# Altium project BT840_Temp.PrjPcb
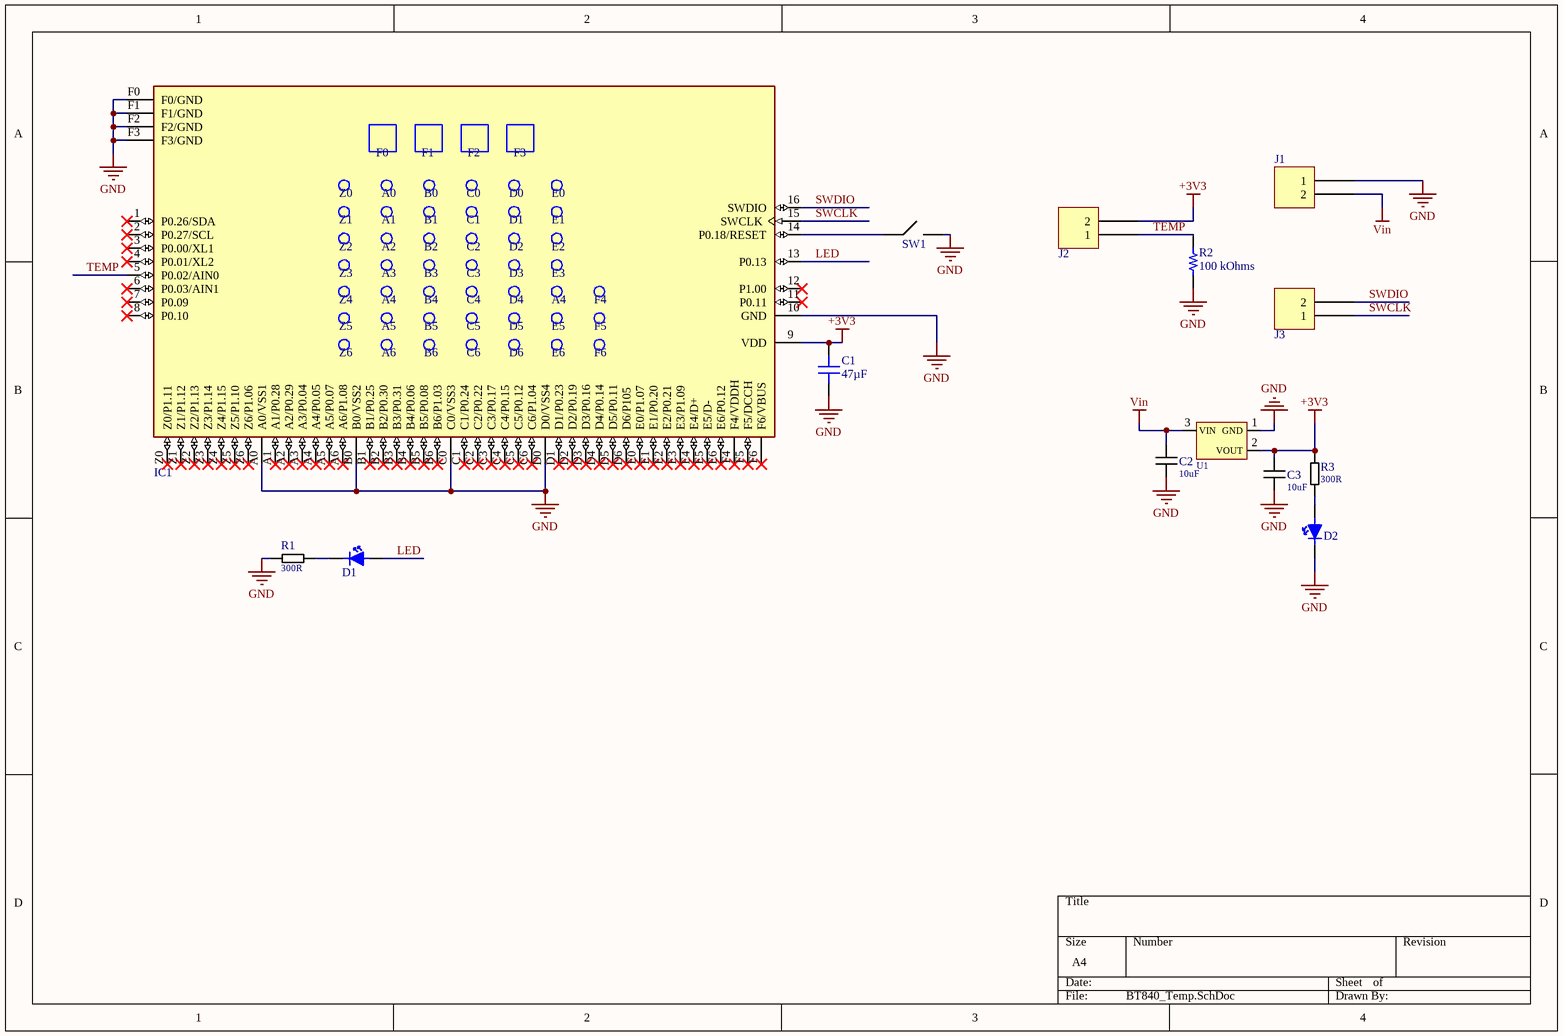
[diagram p0: BT840_Temp.SchDoc]
1 sheet, 14 parts. Net scope: global (net labels, ports and power ports of the same name join across sheets).
Board file: BT840_Temp.PcbDoc

## Sheet BT840_Temp.SchDoc
size A4; SheetNumber: 1; SheetTotal: 1

### Parts
C1  47µF  [CAP 1206_3216 - 1.8MM]
C2  Capacitance: 10uF  [CAP_1206]  (hidden comment: C1206C106J4RAC7800)
C3  Capacitance: 10uF  [CAP_1206]  (hidden comment: C1206C106J4RAC7800)
D1  LED TH  [TH_LED]  (value not drawn)
D2  LED TH  [TH_LED]  (value not drawn)
IC1  BT480F  [BT840F]  (value not drawn)
J1  B2B-PH-K-S(LF)(SN)  [JST B2B-PH-K]  (value not drawn)
J2  B2B-PH-K-S(LF)(SN)  [JST B2B-PH-K]  (value not drawn)
J3  B2B-PH-K-S(LF)(SN)  [JST B2B-PH-K]  (value not drawn)
R1  Resistance: 300R  [RES_1206]  (hidden comment: RT1206BRD07300RL)
R2  100 kOhms  [RES 1206_3216]
R3  Resistance: 300R  [RES_1206]  (hidden comment: RT1206BRD07300RL)
SW1  PTS636 SM43J SMTR LFS  [SMD_Button]  (value not drawn)
U1  AMS1117-3.3V  [SOT223]  (value not drawn)

### Nets
+3V3: C1.2 C3.2 IC1.9(VDD) J2.2 R3.2 U1.2(VOUT)
GND: C1.1 C2.1 C3.1 D2.1 IC1.10(GND) IC1.A0(A0/VSS1) IC1.B0(B0/VSS2) IC1.C0(C0/VSS3) IC1.D0(D0/VSS4) IC1.F0(F0/GND) IC1.F1(F1/GND) IC1.F2(F2/GND) IC1.F3(F3/GND) J1.1 R1.1 R2.1 SW1.2 U1.1(GND)
Vin: C2.2 J1.2 U1.3(VIN)
LED: D1.2 IC1.13(P0.13)
SWCLK: IC1.15(SWCLK) J3.1
SWDIO: IC1.16(SWDIO) J3.2
TEMP: IC1.5(P0.02/AIN0) J2.1 R2.2
NetD1_1: D1.1 R1.2
NetD2_2: D2.2 R3.1
NetIC1_14: IC1.14(P0.18/RESET) SW1.1

Not connected (* = marked no-connect by the designer): IC1 1(P0.26/SDA)* 2(P0.27/SCL)* 3(P0.00/XL1)* 4(P0.01/XL2)* 6(P0.03/AIN1)* 7(P0.09)* 8(P0.10)* 11(P0.11)* 12(P1.00)* A1(A1/P0.28)* A2(A2/P0.29)* A3(A3/P0.04)* A4(A4/P0.05)* A5(A5/P0.07)* A6(A6/P1.08)* B1(B1/P0.25)* B2(B2/P0.30)* B3(B3/P0.31)* B4(B4/P0.06)* B5(B5/P0.08)* B6(B6/P1.03)* C1(C1/P0.24)* C2(C2/P0.22)* C3(C3/P0.17)* C4(C4/P0.15)* C5(C5/P0.12)* C6(C6/P1.04)* D1(D1/P0.23)* D2(D2/P0.19)* D3(D3/P0.16)* D4(D4/P0.14)* D5(D5/P0.11)* D6(D6/P105)* E0(E0/P1.07)* E1(E1/P0.20)* E2(E2/P0.21)* E3(E3/P1.09)* E4(E4/D+)* E5(E5/D-)* E6(E6/P0.12)* F4(F4/VDDH)* F5(F5/DCCH)* F6(F6/VBUS)* Z0(Z0/P1.11)* Z1(Z1/P1.12)* Z2(Z2/P1.13)* Z3(Z3/P1.14)* Z4(Z4/P1.15)* Z5(Z5/P1.10)* Z6(Z6/P1.06)*

### Library data of the parts
C1 = 12066D476MAT2A: CAP CER 47UF 6.3V X5R 1206; manufacturer: AVX Corporation; Tolerance: ±20%; Part Number: 12066D476MAT2A; Value: 47µF; Applications: General Purpose; Capacitance: 47µF; componentlink1description: Datasheet; componentlink1url: http://datasheets.avx.com/cx5r.pdf; componentlink2description: DigiKey Link; componentlink2url: http://digikey.com/product-detail/en/avx-corporation/12066D476MAT2A/478-4532-1-ND/1645883; Device Package: 1206 (3216 Metric); lastupdated: 2.09.2020 01:05:23; Lifecycle Status: Active; Minimum Order: 1; Mounting Type: Surface Mount, MLCC; Operating Temperature: -55°C ~ 85°C; Package / Case: 1206 (3216 Metric); packaging: TapeAndReel; partid: 22636; Part Status: Active; price: 0.23; series: -; Size / Dimension: 0.126" L x 0.063" W (3.20mm x 1.60mm); Supplier 1: DigiKey; Supplier Part Number 1: 478-4532-1-ND; Temperature Coefficient: X5R; Thickness (Max): 0.070" (1.78mm); Voltage - Rated: 6.3V
C2 C3 = CAP 10uF 1206: Cap Ceramic 10uF 16V ±%5 SMD 1206; Manufacturer: KEMET; Manufacturer Part Number: C1206C106J4RACTU; Designed by: Semih AŞÇI; Tolerance: 5%; Dielectric: X7R; Supplier 1: Arrow Electronics; RoHS: Yes; Category: Ceramic Capacitors; Stock 1: 10; Pricing 1: 1=1,52130, 10=1,12380 (USD); Mount: Surface Mount; Case/Package: 1206; Case Code (Metric): 3216; Case Code (Imperial): 1206; Dielectric Material: Ceramic; Min Operating Temperature: -55°C; Max Operating Temperature: 125°C; Package Quantity: 1; Voltage Rating: 16V; Packaging: Tape and Reel; Voltage Rating (DC): 16V; Termination: SMD/SMT; Dissipation Factor: 5%; Series: C; Length: 3.2mm; Width: 0.063inch; Height: 1.6mm; Thickness: 0.071inch; Depth: 1.6mm; Radiation Hardening: No; REACH SVHC: No SVHC; RoHS Compliant: Yes; ComponentLink1URL: http://www.farnell.com/datasheets/2746115.pdf?src-supplier=Farnell; ComponentLink1Description: http://www.farnell.com/datasheets/2746115.pdf?src-supplier=Farnell; ComponentLink2URL: http://www.mouser.com/ds/2/212/KEM_C1002_X7R_SMD-1102033.pdf?src-supplier=Mouser; ComponentLink2Description: http://www.mouser.com/ds/2/212/KEM_C1002_X7R_SMD-1102033.pdf?src-supplier=Mouser; ComponentLink3URL: http://components.arrow.com/part/dataview/46514886S8616008N7429?src-supplier=Arrow+Electronics; ComponentLink3Description: http://components.arrow.com/part/dataview/46514886S8616008N7429?src-supplier=Arrow+Electronics; ComponentLink4URL: https://api.kemet.com/component-edge/download/datasheet/C1206C106J4RACTU.pdf?src-supplier=Digi-Key; ComponentLink4Description: https://api.kemet.com/component-edge/download/datasheet/C1206C106J4RACTU.pdf?src-supplier=Digi-Key; ComponentLink5URL: http://www.farnell.com/datasheets/2746115.pdf?src-supplier=Newark; ComponentLink5Description: http://www.farnell.com/datasheets/2746115.pdf?src-supplier=Newark; ComponentLink6URL: http://capacitoredge.kemet.com/capedge2/DataSheet?pn=C1206C106J4RAC7800&src-supplier=Avnet; ComponentLink6Description: http://capacitoredge.kemet.com/capedge2/DataSheet?pn=C1206C106J4RAC7800&src-supplier=Avnet; ComponentLink7URL: http://www.farnell.com/datasheets/2746115.pdf?src-supplier=Element14; ComponentLink7Description: http://www.farnell.com/datasheets/2746115.pdf?src-supplier=Element14; Supplier Part Number 1: C1206C106J4RACTU
D1 D2 = LED TH: Radial red led; Designed by: Semih AŞÇI
IC1 = BT840F: BLE 5 Module: Nordic nRF52840 SoC (Range 930 Meters); Manufacturer: Fanstel; Designed by: Semih AŞÇI; Interface: SPI,USB; Frequency: 2.4GHz; Data Rate: 12Mbps; Sensitivity: -96dBm; Memory Size: 256KB; Supplier 1: Digi-Key; Manufacturer Part Number: BT840F; RoHS: No; Category: RF Receivers, Transceivers; Pricing 1: 1=14,04000, 10=12,70700, 25=11,70400, 100=10,70080, 250=10,03200, 500=9,36320 (USD); Mount: Surface Mount; Case/Package: SMD/SMT; Min Operating Temperature: -40°C; Max Operating Temperature: 85°C; Packaging: Tape and Reel; ComponentLink1URL: http://www.fanstel.com/s/BlueNor_BT840F_datasheets.pdf?src-supplier=Digi-Key; ComponentLink1Description: http://www.fanstel.com/s/BlueNor_BT840F_datasheets.pdf?src-supplier=Digi-Key; Supplier Part Number 1: 1914-1019-1-ND
J1-J3 = B2B-PH-K-S(LF)(SN): CONN HEADER VERT 2POS 2MM; Manufacturer: JST Sales America Inc.; Contact Length - Mating: 0.130" (3.30mm); Contact Length - Post: 0.134" (3.40mm); Current Rating (Amps): 2A; Material Flammability Rating: UL94 V-0; Number of Positions: 2; Number of Positions Loaded: All; Overall Contact Length: 0.333" (8.45mm); Pitch - Mating: 0.079" (2.00mm); Shrouding: Shrouded - 4 Wall; Style: Board to Cable/Wire; Voltage Rating: 100V; Part Number: B2B-PH-K-S(LF)(SN); ComponentLink1Description: Datasheet; ComponentLink1URL: http://www.jst-mfg.com/product/pdf/eng/ePH.pdf; ComponentLink2Description: DigiKey Link; ComponentLink2URL: http://digikey.com/product-detail/en/jst-sales-america-inc/B2B-PH-K-S-LF-SN/455-1704-ND/926611; Connector Type: Header; Contact Finish - Mating: Tin; Contact Finish - Post: Tin; Contact Material: Brass; Contact Shape: Square; Contact Type: Male Pin; Fastening Type: Detent Lock; Insulation Color: Natural; Insulation Height: 0.236" (6.00mm); Insulation Material: Polyamide (PA66), Nylon 6/6; LastUpdated: 3.01.2020 23:40:58; Lifecycle Status: Active; Minimum Order: 1; Mounting Type: Through Hole; Number of Rows: 1; Operating Temperature: -25°C ~ 85°C; Packaging: Bulk; PartId: 11; Part Status: Active; Price: 0.17; Series: PH; Supplier 1: DigiKey; Supplier Part Number 1: 455-1704-ND; Termination: Press-Fit, Solder
R1 R3 = RES 300 OHM 1206: Res 300 Ohm %0.1   SMD 1206; Manufacturer: Yageo; Designed by: Semih AŞÇI; Tolerance: 0.1%; Power Rating: 250mW; Voltage Rating: 200V; Temperature Coefficient: 25ppm/°C; Supplier 1: Digi-Key; Manufacturer Part Number: RT1206BRD07300RL; RoHS: Yes; Category: Chip SMD Resistors; Stock 1: 18682; Pricing 1: 1=0,65000, 10=0,50000, 100=0,21000, 1000=0,11585, 2500=0,10861 (USD); Case/Package: 1206; Case Code (Metric): 3216; Case Code (Imperial): 1206; Contact Plating: Tin,Matte; Min Operating Temperature: -55°C; Max Operating Temperature: 125°C; Packaging: Tape and Reel; Resistor Type: Thin Film; Termination: SMD/SMT; Voltage Rating (DC): 200V; Series: RT; Max Power Dissipation: 250mW; Number of Terminations: 2; Length: 3.1mm; Width: 1.6mm; Height: 550um; Radiation Hardening: No; Lead Free: Lead Free; RoHS Compliant: Yes; ComponentLink1URL: https://datasheet.ciiva.com/8886/pyu-rt-1-to-0-05-rohs-l-4-8886328.pdf?src-supplier=Avnet; ComponentLink1Description: https://datasheet.ciiva.com/8886/pyu-rt-1-to-0-05-rohs-l-4-8886328.pdf?src-supplier=Avnet; ComponentLink2URL: https://datasheet.ciiva.com/12705/pyu-rt-1-to-0-05-rohs-l-4-12705053.pdf?src-supplier=Mouser; ComponentLink2Description: https://datasheet.ciiva.com/12705/pyu-rt-1-to-0-05-rohs-l-4-12705053.pdf?src-supplier=Mouser; Supplier Part Number 1: 13-RT1206BRD07300RLCT-ND
R2 = RNCS1206BKE100K: RES 100K OHM 0.1% 1/8W 1206; Manufacturer: Stackpole Electronics Inc; Power (Watts): 0.125W, 1/8W; Temperature Coefficient: ±25ppm/°C; Part Number: RNCS1206BKE100K; ComponentLink1Description: Datasheet; ComponentLink1URL: https://www.seielect.com/catalog/sei-rncs_rnch.pdf; ComponentLink2Description: DigiKey Link; ComponentLink2URL: https://www.digikey.com/en/products/detail/stackpole-electronics-inc/RNCS1206BKE100K/1800321; Composition: Thin Film; Device Package: 1206 (3216 Metric); Features: Anti-Corrosive, Automotive AEC-Q200, Moisture Resistant; Height - Seated (Max): 0.026" (0.65mm); LastUpdated: 19.09.2022 13:29:58; Lifecycle Status: Active; Minimum Order: 1; Number of Terminations: 2; Operating Temperature: -55°C ~ 155°C; Package / Case: 1206 (3216 Metric); Packaging: TapeAndReel; PartId: 26854; Part Status: Active; Price: 0.08; Ratings: AEC-Q200; Resistance: 100 kOhms; Series: RNCS; Size / Dimension: 0.120" L x 0.061" W (3.05mm x 1.55mm); Supplier 1: DigiKey; Supplier Part Number 1: RNCS1206BKE100KCT-ND; Supplier Device Package: 1206; Tolerance: ±0.1%; Value: 100 kOhms
SW1 = SMD Button: PTS636 Series SPST-NO Off-Mom 180 gf Top Actuated J Lead SMT Tactile Switch; Manufacturer: ITT C&K; Designed by: Semih AŞÇI; Supplier 1: Digi-Key; Manufacturer Part Number: PTS636SM43JSMTRLFS; RoHS: No; Stock 1: 11521; Pricing 1: 1=0,15000, 10=0,14300, 25=0,13520, 100=0,12300, 250=0,11568, 500=0,10582 (USD); Supplier Part Number 1: CKN12317-1-ND
U1 = AMS1117-3.3V SMD: 3.3V Voltage regulator; Manufacturer: Advanced Monolithic Systems; Designed by: Semih AŞÇI; Manufacturer Part Number: AMS1117-3.3; RoHS Compliant: Yes